# Altium schematic sheet asynchronous.SchDoc
size A4; SheetNumber: 5; SheetTotal: 6
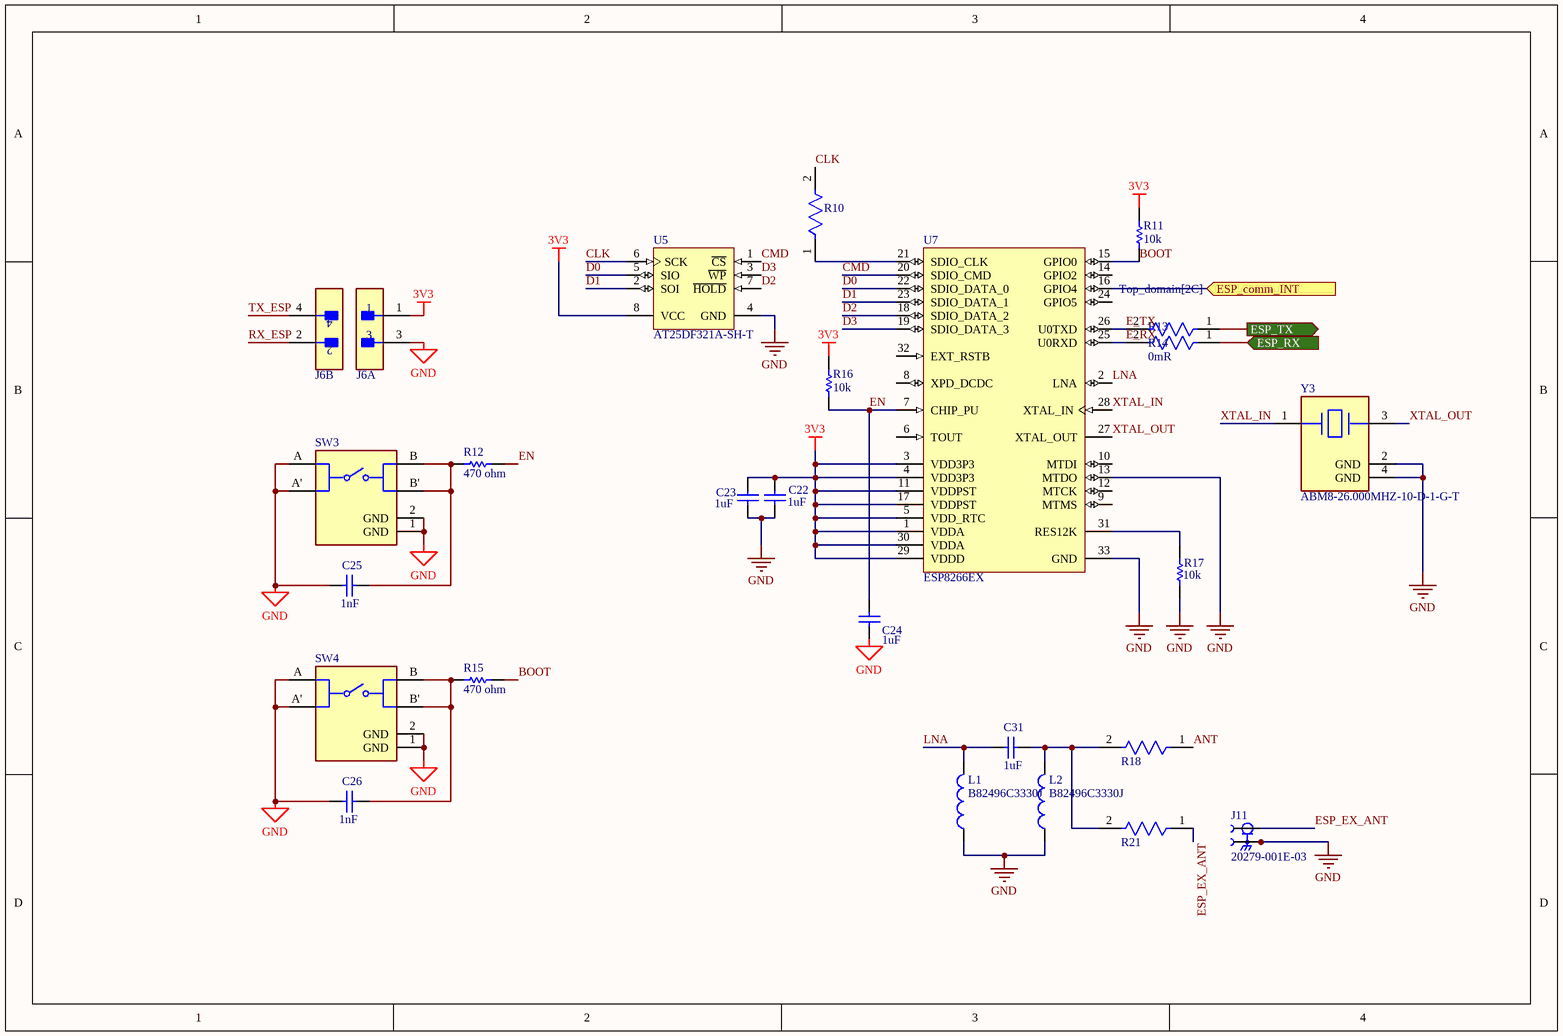
[diagram p0: asynchronous.SchDoc]

## Parts
C22  Parameter 1: 1uF  [CAPC2013X145X50LL20T25]  (hidden comment: C0805C105K4PACTU)
C23  Parameter 1: 1uF  [CAPC2013X145X50LL20T25]  (hidden comment: C0805C105K4PACTU)
C24  Parameter 1: 1uF  [CAPC2013X145X50LL20T25]  (hidden comment: C0805C105K4PACTU)
C25  Parameter 1: 1nF  [CAPC2013X145X48LL20T23]  (hidden comment: VJ0805D102KXAAJ)
C26  Parameter 1: 1nF  [CAPC2013X145X48LL20T23]  (hidden comment: VJ0805D102KXAAJ)
C31  Parameter 1: 1uF  [CAPC2013X145X50LL20T25]  (hidden comment: C0805C105K4PACTU)
J6  PEC02DABN  [FP-PEC02DABN-MFG]  (value not drawn)  (parts A,B of 2)
J11  20279-001E-03  [IPEX_20279-001E-03]
L1  B82496C3330J  [INDC1608X90X30LL10T20]
L2  B82496C3330J  [INDC1608X90X30LL10T20]
R10  CR0805-J/-000ELF  [FP-CR0805-IPC_C]  (value not drawn)
R11  Parameter 1: 10k  [RESC2013X60X35NL10T20]  (hidden comment: RC0805FR-0710KL)
R12  Parameter 1: 470 ohm  [RESC2013X50X30LL20T20]  (hidden comment: CRCW0805470RFKEA)
R13  Resistance: 0mR  [FP-CR0805-IPC_C]  (hidden comment: CR0805-J/-000ELF)
R14  CR0805-J/-000ELF  [FP-CR0805-IPC_C]  (value not drawn)
R15  Parameter 1: 470 ohm  [RESC2013X50X30LL20T20]  (hidden comment: CRCW0805470RFKEA)
R16  Parameter 1: 10k  [RESC2013X60X35NL10T20]  (hidden comment: RC0805FR-0710KL)
R17  Parameter 1: 10k  [RESC2013X60X35NL10T20]  (hidden comment: RC0805FR-0710KL)
R18  CR0805-J/-000ELF  [FP-CR0805-IPC_C]  (value not drawn)
R21  CR0805-J/-000ELF  [FP-CR0805-IPC_C]  (value not drawn)
SW3  EVQ-PLMA15  [FP-EVQ-PLMA15-MFG]  (value not drawn)
SW4  EVQ-PLMA15  [FP-EVQ-PLMA15-MFG]  (value not drawn)
U5  AT25DF321A-SH-T  [ADST-S2-8_N]
U7  ESP8266EX  [ESFS-QFN-32_L]
Y3  ABM8-26.000MHZ-10-D-1-G-T  [FP-ABM8-MFG]

## Ports
ESP_comm_INT (in, see Top_domain[2C]), ESP_RX (in, see Top_domain[2C]), ESP_TX (out, see Top_domain[3C])

## Nets
3V3: C22.2 C23.2 J6.1 R11.1 R16.1 U5.8(VCC) U7.1(VDDA) U7.3(VDD3P3) U7.4(VDD3P3) U7.5(VDD_RTC) U7.11(VDDPST) U7.17(VDDPST) U7.29(VDDD) U7.30(VDDA)
GND: C22.1 C23.1 C24.1 C25.1 C26.1 J6.3 J11.2(GROUND) J11.3(GROUND) L1.1 L2.1 R17.1 SW3.1(GND) SW3.2(GND) SW3.A SW3.A' SW4.1(GND) SW4.2(GND) SW4.A SW4.A' U5.4(GND) U7.13(MTDO) U7.33(GND) Y3.2(GND) Y3.4(GND)
ANT: R18.1
BOOT: R11.2 R15.2 U7.15(GPIO0)
CLK: R10.2 U5.6(SCK)
CMD: U5.1(~{CS}) U7.20(SDIO_CMD)
D0: U5.5(SIO) U7.22(SDIO_DATA_0)
D1: U5.2(SOI) U7.23(SDIO_DATA_1)
D2: U5.7(~{HOLD}) U7.18(SDIO_DATA_2)
D3: U5.3(~{WP}) U7.19(SDIO_DATA_3)
E_RX: R13.2 U7.25(U0RXD)
E_TX: R14.2 U7.26(U0TXD)
EN: C24.2 R12.2 R16.2 U7.7(CHIP_PU)
ESP_comm_INT: U7.16(GPIO4) ; port ESP_comm_INT
ESP_EX_ANT: J11.1(SIGNAL) R21.1
ESP_RX: R13.1 ; port ESP_RX
ESP_TX: R14.1 ; port ESP_TX
LNA: C31.2 L1.2 U7.2(LNA)
RX_ESP: J6.2
TX_ESP: J6.4
XTAL_IN: U7.28(XTAL_IN) Y3.1
XTAL_OUT: U7.27(XTAL_OUT) Y3.3
NetC25_2: C25.2 R12.1 SW3.B SW3.B'
NetC26_2: C26.2 R15.1 SW4.B SW4.B'
NetC31_1: C31.1 L2.2 R18.2 R21.2
NetR10_1: R10.1 U7.21(SDIO_CLK)
NetR17_2: R17.2 U7.31(RES12K)

Not connected (* = marked no-connect by the designer): U7 6(TOUT) 8(XPD_DCDC) 9(MTMS) 10(MTDI) 12(MTCK) 14(GPIO2) 24(GPIO5) 32(EXT_RSTB)

## Library data of the parts
C22-C24 C31 = CMP-1036-04746-2: Manufacturer: Kemet; Part Number: C0805C105K4PACTU
C25 C26 = CMP-2007-03135-1: Manufacturer: Vitramon; Part Number: VJ0805D102KXAAJ
J6 = CMP-25680-000069-1: CONN HEADER VERT 4POS 2.54MM; Number of Contacts: 4; Row Spacing: 0.1inch; Connector Type: Male Pin; Gender: Male; Series: -; Housing Material: Plastic; Contact Material: Bronze; Length: 5.08mm; RoHS Compliant: Yes; Width: 5.08mm; Min Operating Temperature: -65°C; Contact Shape: Square; Pitch: 0.1inch; Lead Free: Lead Free; Number of Positions: 4; Fastening Type: Pull; Contact Plating: Tin; Flammability Rating: UL94 V-0; Packaging: Bulk; Termination: Solder; Max Operating Temperature: 125°C; Package Quantity: 1; Number of Rows: 2; Contact Mating Length: 0.23inch; Contact Finish - Mating: TIN; Height: 2.54mm; Insulation Color: Black; Mount: Through Hole; Insulation Material: PBT; Color: Black; Housing Color: Black; Contact Type: Male Pin
J11 = 20279-001E-03: 1 POS Vertical SMD Small form factor with big performance through 6 GHz connector,MHF, RF, micro-coaxial MHF I Receptacle; MF: I-PEX; SnapEDA_Link: https://www.snapeda.com/parts/20279-001E-03/I-PEX/view-part/?ref=snap; Package: None; Value: *; MP: 20279-001E-03; Check_prices: https://www.snapeda.com/parts/20279-001E-03/I-PEX/view-part/?ref=eda
L1 L2 = CMP-2000-05913-1: Unshielded Wirewound Inductor, 33 nH, 350 mA, -55 to 150 degC, 0603 (1608 Metric), RoHS, Tape and Reel; Manufacturer: EPCOS-(TDK); Q @ Freq: 14@100MHz; Inductance: 33nH; Material - Core: Ceramic; Frequency - Self Resonant: 3GHz; DC Resistance (DCR): 600mOhmMax; Tolerance: ±5%; Frequency - Test: 100MHz; Current Rating: 350mA; Manufacturer URL: http://www.tdk.com/; Type: Wirewound; Mounting Type: SurfaceMount; Mounting Technology: SurfaceMount; Height - Seated (Max): 0.035"(0.90mm); Datasheet URL: https://en.tdk.eu/inf/30/db/ind_2008/b82496c.pdf; Shielding: Unshielded; Operating Temperature: -; Size / Dimension: 0.063"Lx0.031"W(1.60mmx0.80mm); Series: SIMID; Current - Saturation: -; Ratings: AEC-Q200; Packaging: CutTape(CT); Package Reference: 0603; Datasheet Version: 07/2016; Category: Inductors,Coils,Chokes; Package Description: 2-Pin Surface Mount Device, Body 1.6 x 0.8 mm; Family: FixedInductors; Package / Case: 0603(1608Metric)
R10 R14 R18 R21 = CMP-07231-004348-1: Thick Film Chip Resistors 0805 0Ω 0.125W 5%; Voltage Rating: 150V; Max Power Dissipation: 125mW; Temperature Coefficient: 500ppm/°C; Resistance: 0mR; Min Operating Temperature: -55°C; Case Code (Metric): 2012; Height: 0.5mm; Contact Plating: Tin; Thickness: 508um; Military Standard: Not; Composition: Thick Film; REACH SVHC: No SVHC; Voltage Rating (DC): 150V; Length: 2mm; Radiation Hardening: No; Case/Package: 0805; Package Quantity: 5000; Number of Pins: 2; Max Operating Temperature: 155°C; Case Code (Imperial): 0805; Mount: Surface Mount; Depth: 1.25mm; Packaging: Tape and Reel; Tolerance: 5%; Termination: SMD/SMT; Width: 1.25mm; Power Rating: 125mW
R11 R16 R17 = CMP-1659-00013-4: Chip Resistor, 10 KOhm, +/- 1%, 0.125 W, -55 to 155 degC, 0805 (2012 Metric), RoHS, Tape and Reel; Manufacturer: Yageo; Voltage Rating: 150 V; Mount: Surface Mount; ComponentLink1Description: Manufacturer URL; ComponentLink2URL: http://www.yageo.com/documents/recent/PYu-RC_Group_51_RoHS_L_04.pdf; Pins: 2; Length: 2 mm; Min Operating Temperature: -55 degC; Height: 0.5 mm; Mounting Technology: Surface Mount; RoHSCompliant: true; REACH SVHC: No SVHC; ComponentLink1URL: http://www.yageo.com/; Max Operating Temperature: 155 degC; PackageReference: 0805; DatasheetVersion: Rev. 4, 02/2016; Package Quantity: 5000; Packaging: Tape and Reel; ComponentLink2Description: Datasheet; PackageDescription: 2-Pin Surface Mounted Device, Body 2 x 1.25 mm
R12 R15 = CMP-2001-03932-1: Manufacturer: Vishay Dale; Part Number: CRCW0805470RFKEA
R13 = CMP-07231-004348-1: Thick Film Chip Resistors 0805 0Ω 0.125W 5%; Voltage Rating: 150V; Max Power Dissipation: 125mW; Temperature Coefficient: 500ppm/°C; Min Operating Temperature: -55°C; Case Code (Metric): 2012; Height: 0.5mm; Contact Plating: Tin; Thickness: 508um; Military Standard: Not; Composition: Thick Film; REACH SVHC: No SVHC; Voltage Rating (DC): 150V; Length: 2mm; Radiation Hardening: No; Case/Package: 0805; Package Quantity: 5000; Number of Pins: 2; Max Operating Temperature: 155°C; Case Code (Imperial): 0805; Mount: Surface Mount; Depth: 1.25mm; Packaging: Tape and Reel; Tolerance: 5%; Termination: SMD/SMT; Width: 1.25mm; Power Rating: 125mW
SW3 SW4 = CMP-05618-000006-1: SWITCH TACTILE SPST-NO 0.02A 15V; Manufacturer: Panasonic Electronic Components; Operating Force: 2.6N; Contact Resistance: 50mΩ; Contact Current Rating: 20mA; Electromechanical Life: 200000Cycles; Throw Configuration: SPST-NO; Automotive: No; Digikey Description: SWITCH TACTILE SPST-NO 0.02A 15V; Device Class L3: Tactile Switches; Device Class L2: Switches; Temperature Range Low: -20°C; ComponentLink2Description: Datasheet; RoHS: TRUE; Mount: Surface Mount; Package: 0; Height: 1.7mm; Octopart: https://octopart.com/evq-plma15-panasonic-39850235; Temperature Range High: +70°C; Device Class L1: Electromechanical; Category: Switch; Mouser Description: Tactile Switches FLAT ACT 2.6NF 4.6x3.4x1.5mm; Voltage Rating Dc: 15V; Manufacturer Part Number: EVQ-PLMA15; ComponentLink2URL: https://datasheet.ciiva.com/8164/atv0000ce2-8164994.pdf; Lead Free: Yes; Temperature: -20°C to +70°C
U5 = CMP-0005-00011-1: SPI Serial Flash Memory, 32 Megabit, 100 MHz, 2.7 to 3.6 V, -40 to 85 degC, 8-Pin SOIC (S2-8), RoHS, Tape and Reel; Manufacturer: Adesto; Max. Freq: 100 MHz; DatasheetVersion: Rev. 3686E; Interface: Serial; Packing: Tape and Reel; Mounting Technology: Surface Mount; Device Density: 32 Megabit; PackageDescription: 8-Pin Plastic Gull Wing Small Outline Package, Body 5.24 x 5.29 mm, Pitch 1.27 mm; PackageReference: S2-8; ComponentLink3URL: http://www.adestotech.com/sites/default/files/datasheets/doc3668.pdf; ComponentLink1Description: Manufacturer URL; Operating Voltage: 2.7 to 3.6 V; ComponentLink2Description: Datasheet; Operating Temperature: -40 to 85 degC; PackageVersion: Rev. F; ComponentLink3Description: Package Specification; ComponentLink1URL: http://www.adestotech.com/; RoHS: TRUE; PartNumber: AT25DF321A-SH-T; ComponentLink2URL: http://www.adestotech.com/sites/default/files/datasheets/doc3686.pdf
U7 = CMP-2000-07453-1: Low-Power, Highly-Integrated Wi-Fi Solution, 2.5 to 3.6 V, 80 mA, -40 to 125 degC, 32-Pin QFN; Manufacturer: Espressif Systems; Mounting Technology: SurfaceMount; Datasheet URL: http://espressif.com/sites/default/files/documentation/0a-esp8266ex_datasheet_en.pdf; Package Reference: QFN-32; Package Description: 32-Pin Quad Falt No-Lead, Body 5 x 5 mm, Pitch 0.5 mm; Manufacturer URL: http://espressif.com; Datasheet Version: Rev. 5.4, 04/2017
Y3 = CMP-27762-004449-1: Crystal 26MHz ±10ppm 10pF SMD-4 3.2mm x 2.5mm; Capacitance: 1E-11F; Operating Frequency: 26 MHz; Lead Free: Lead Free; Frequency: 26MHz; Min Operating Temperature: -40°C; Max Operating Temperature: 85°C; Frequency Tolerance: 10ppm; Load Capacitance: 10pF